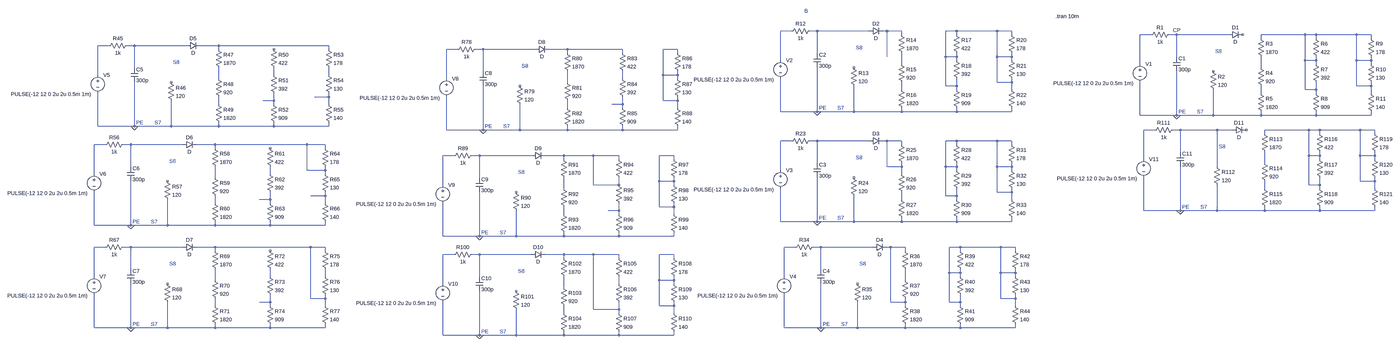
[diagram p0: schematic teste3 - Copia.asc, whole sheet]
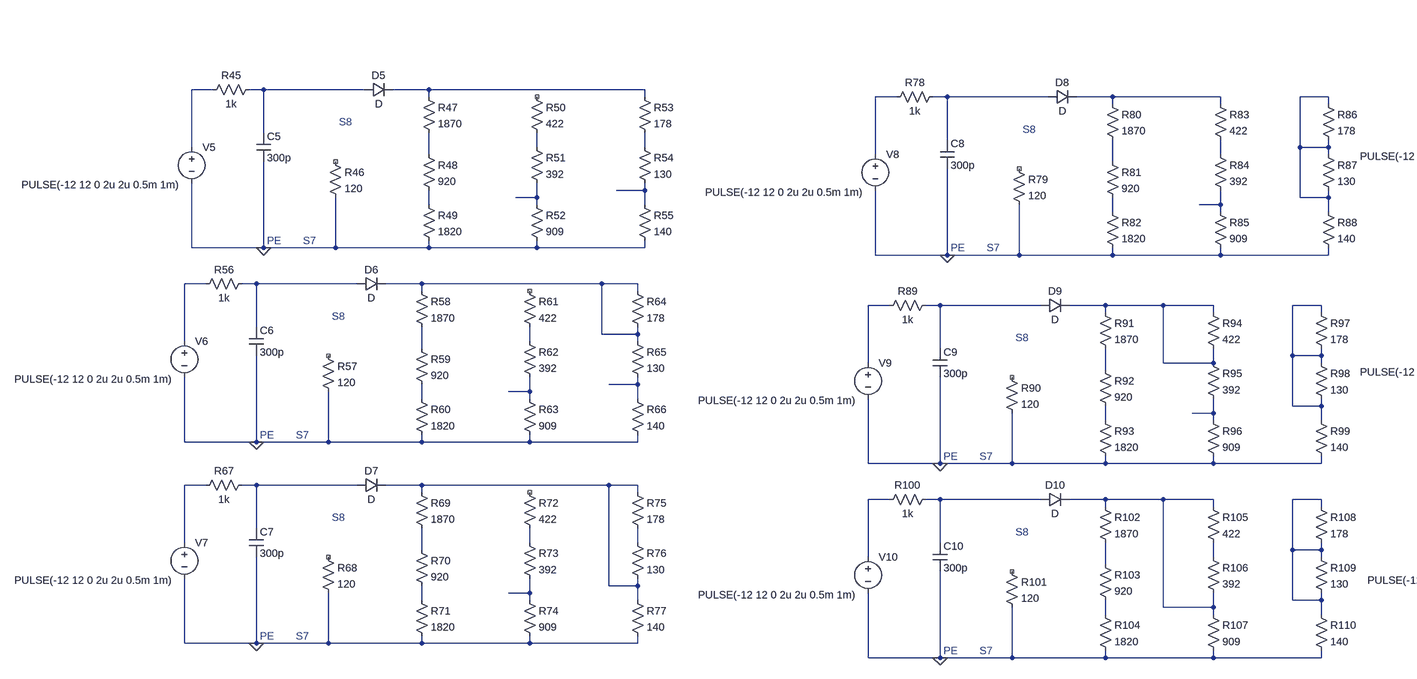
[diagram p1: schematic teste3 - Copia.asc, part, row 1 of 1, column 1 of 2]
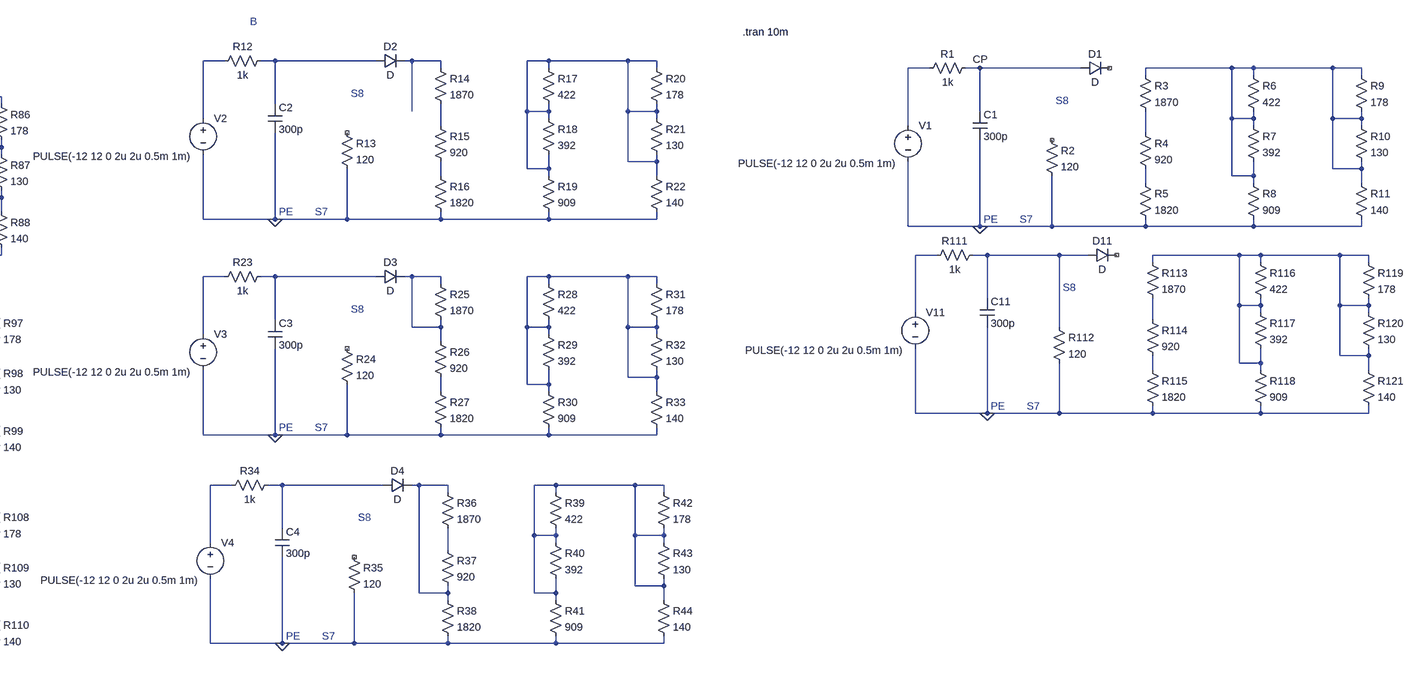
[diagram p2: schematic teste3 - Copia.asc, part, row 1 of 1, column 2 of 2]
teste3 - Copia.asc, the LTspice schematic file:
Version 4.1
SHEET 1 3600 2600
WIRE -1792 -48 -1840 -48
WIRE -1680 -48 -1712 -48
WIRE -1456 -48 -1680 -48
WIRE -1376 -48 -1392 -48
WIRE -1312 -48 -1376 -48
WIRE -1072 -48 -1120 -48
WIRE -896 -48 -1072 -48
WIRE -832 -48 -896 -48
WIRE -1312 -32 -1312 -48
WIRE -1072 -32 -1072 -48
WIRE -832 -32 -832 -48
WIRE 80 -32 32 -32
WIRE 192 -32 160 -32
WIRE 416 -32 192 -32
WIRE 752 -32 560 -32
WIRE 800 -32 752 -32
WIRE 976 -32 800 -32
WIRE 1040 -32 976 -32
WIRE 560 -16 560 -32
WIRE 800 -16 800 -32
WIRE 1040 -16 1040 -32
WIRE -4768 16 -4816 16
WIRE -4656 16 -4688 16
WIRE -4432 16 -4656 16
WIRE -4288 16 -4368 16
WIRE -3808 16 -4288 16
WIRE -4288 32 -4288 16
WIRE -3808 32 -3808 16
WIRE -3248 32 -3296 32
WIRE -3136 32 -3168 32
WIRE -2912 32 -3136 32
WIRE -2768 32 -2848 32
WIRE -2528 32 -2768 32
WIRE -2288 32 -2352 32
WIRE -2768 48 -2768 32
WIRE -2528 48 -2528 32
WIRE -2288 48 -2288 32
WIRE -1680 48 -1680 -48
WIRE -1376 64 -1376 -48
WIRE -1120 64 -1120 -48
WIRE -1072 64 -1072 48
WIRE -1072 64 -1120 64
WIRE -896 64 -896 -48
WIRE -832 64 -832 48
WIRE -832 64 -896 64
WIRE 192 64 192 -32
WIRE -1840 80 -1840 -48
WIRE -1072 80 -1072 64
WIRE -832 80 -832 64
WIRE 752 80 752 -32
WIRE 800 80 800 64
WIRE 800 80 752 80
WIRE 976 80 976 -32
WIRE 1040 80 1040 64
WIRE 1040 80 976 80
WIRE -1312 96 -1312 48
WIRE 32 96 32 -32
WIRE 800 96 800 80
WIRE 1040 96 1040 80
WIRE -4656 112 -4656 16
WIRE 560 112 560 64
WIRE -3136 128 -3136 32
WIRE -4816 144 -4816 16
WIRE -4048 144 -4048 112
WIRE -3808 144 -3808 112
WIRE -2352 144 -2352 32
WIRE -2288 144 -2288 128
WIRE -2288 144 -2352 144
WIRE -4288 160 -4288 112
WIRE -3296 160 -3296 32
WIRE -2528 160 -2528 128
WIRE -2288 160 -2288 144
WIRE -2768 176 -2768 128
WIRE -896 176 -896 64
WIRE -832 176 -832 160
WIRE -832 176 -896 176
WIRE -1120 192 -1120 64
WIRE -1072 192 -1072 160
WIRE -1072 192 -1120 192
WIRE 976 192 976 80
WIRE 1040 192 1040 176
WIRE 1040 192 976 192
WIRE -1312 208 -1312 176
WIRE -1072 208 -1072 192
WIRE -832 208 -832 176
WIRE 752 208 752 80
WIRE 800 208 800 176
WIRE 800 208 752 208
WIRE 560 224 560 192
WIRE 800 224 800 208
WIRE 1040 224 1040 192
WIRE -3808 240 -3808 224
WIRE -3808 240 -3872 240
WIRE -4048 256 -4048 224
WIRE -4048 256 -4096 256
WIRE -2352 256 -2352 144
WIRE -2288 256 -2288 240
WIRE -2288 256 -2352 256
WIRE -4288 272 -4288 240
WIRE -4048 272 -4048 256
WIRE -3808 272 -3808 240
WIRE -2528 272 -2528 240
WIRE -2528 272 -2576 272
WIRE -2768 288 -2768 256
WIRE -2528 288 -2528 272
WIRE -2288 288 -2288 256
WIRE -1840 304 -1840 160
WIRE -1680 304 -1680 112
WIRE -1680 304 -1840 304
WIRE -1520 304 -1520 192
WIRE -1520 304 -1680 304
WIRE -1312 304 -1312 288
WIRE -1312 304 -1520 304
WIRE -1072 304 -1072 288
WIRE -1072 304 -1312 304
WIRE -832 304 -832 288
WIRE -832 304 -1072 304
WIRE 32 320 32 176
WIRE 192 320 192 128
WIRE 192 320 32 320
WIRE 352 320 352 208
WIRE 352 320 192 320
WIRE 560 320 560 304
WIRE 560 320 352 320
WIRE 800 320 800 304
WIRE 800 320 560 320
WIRE 1040 320 1040 304
WIRE 1040 320 800 320
WIRE -4816 368 -4816 224
WIRE -4656 368 -4656 176
WIRE -4656 368 -4816 368
WIRE -4496 368 -4496 256
WIRE -4496 368 -4656 368
WIRE -4288 368 -4288 352
WIRE -4288 368 -4496 368
WIRE -4048 368 -4048 352
WIRE -4048 368 -4288 368
WIRE -3808 368 -3808 352
WIRE -3808 368 -4048 368
WIRE -3296 384 -3296 240
WIRE -3136 384 -3136 192
WIRE -3136 384 -3296 384
WIRE -2976 384 -2976 272
WIRE -2976 384 -3136 384
WIRE -2768 384 -2768 368
WIRE -2768 384 -2976 384
WIRE -2528 384 -2528 368
WIRE -2528 384 -2768 384
WIRE -2288 384 -2288 368
WIRE -2288 384 -2528 384
WIRE 96 384 48 384
WIRE 208 384 176 384
WIRE 368 384 208 384
WIRE 432 384 368 384
WIRE 768 384 576 384
WIRE 816 384 768 384
WIRE 992 384 816 384
WIRE 1056 384 992 384
WIRE 576 400 576 384
WIRE 816 400 816 384
WIRE 1056 400 1056 384
WIRE -1792 432 -1840 432
WIRE -1680 432 -1712 432
WIRE -1456 432 -1680 432
WIRE -1376 432 -1392 432
WIRE -1312 432 -1376 432
WIRE -1072 432 -1120 432
WIRE -896 432 -1072 432
WIRE -832 432 -896 432
WIRE -4784 448 -4832 448
WIRE -4672 448 -4704 448
WIRE -4448 448 -4672 448
WIRE -4304 448 -4384 448
WIRE -3904 448 -4304 448
WIRE -3824 448 -3904 448
WIRE -1312 448 -1312 432
WIRE -1072 448 -1072 432
WIRE -832 448 -832 432
WIRE -4304 464 -4304 448
WIRE -3824 464 -3824 448
WIRE 208 480 208 384
WIRE -3264 496 -3312 496
WIRE -3152 496 -3184 496
WIRE -2928 496 -3152 496
WIRE -2784 496 -2864 496
WIRE -2656 496 -2784 496
WIRE -2544 496 -2656 496
WIRE -2304 496 -2368 496
WIRE 768 496 768 384
WIRE 816 496 816 480
WIRE 816 496 768 496
WIRE 992 496 992 384
WIRE 1056 496 1056 480
WIRE 1056 496 992 496
WIRE -2784 512 -2784 496
WIRE -2544 512 -2544 496
WIRE -2304 512 -2304 496
WIRE 48 512 48 384
WIRE 816 512 816 496
WIRE 1056 512 1056 496
WIRE -1680 528 -1680 432
WIRE 576 528 576 480
WIRE -4672 544 -4672 448
WIRE -1376 544 -1376 432
WIRE -1312 544 -1312 528
WIRE -1312 544 -1376 544
WIRE -1120 544 -1120 432
WIRE -1072 544 -1072 528
WIRE -1072 544 -1120 544
WIRE -896 544 -896 432
WIRE -832 544 -832 528
WIRE -832 544 -896 544
WIRE 368 544 368 384
WIRE -3904 560 -3904 448
WIRE -3824 560 -3824 544
WIRE -3824 560 -3904 560
WIRE -1840 560 -1840 432
WIRE -1072 560 -1072 544
WIRE -832 560 -832 544
WIRE -4832 576 -4832 448
WIRE -4064 576 -4064 544
WIRE -3824 576 -3824 560
WIRE -1312 576 -1312 544
WIRE -4304 592 -4304 544
WIRE -3152 592 -3152 496
WIRE -2368 608 -2368 496
WIRE -2304 608 -2304 592
WIRE -2304 608 -2368 608
WIRE 992 608 992 496
WIRE 1056 608 1056 592
WIRE 1056 608 992 608
WIRE -3312 624 -3312 496
WIRE -2656 624 -2656 496
WIRE -2544 624 -2544 592
WIRE -2544 624 -2656 624
WIRE -2304 624 -2304 608
WIRE 768 624 768 496
WIRE 816 624 816 592
WIRE 816 624 768 624
WIRE -2784 640 -2784 592
WIRE 576 640 576 608
WIRE 816 640 816 624
WIRE 1056 640 1056 608
WIRE -896 656 -896 544
WIRE -832 656 -832 640
WIRE -832 656 -896 656
WIRE -3824 672 -3824 656
WIRE -3824 672 -3888 672
WIRE -1120 672 -1120 544
WIRE -1072 672 -1072 640
WIRE -1072 672 -1120 672
WIRE -4064 688 -4064 656
WIRE -4064 688 -4112 688
WIRE -1312 688 -1312 656
WIRE -1072 688 -1072 672
WIRE -832 688 -832 656
WIRE -4304 704 -4304 672
WIRE -4064 704 -4064 688
WIRE -3824 704 -3824 672
WIRE -2368 720 -2368 608
WIRE -2304 720 -2304 704
WIRE -2304 720 -2368 720
WIRE -2544 736 -2544 704
WIRE -2544 736 -2592 736
WIRE 48 736 48 592
WIRE 208 736 208 544
WIRE 208 736 48 736
WIRE 368 736 368 624
WIRE 368 736 208 736
WIRE 576 736 576 720
WIRE 576 736 368 736
WIRE 816 736 816 720
WIRE 816 736 576 736
WIRE 1056 736 1056 720
WIRE 1056 736 816 736
WIRE -2784 752 -2784 720
WIRE -2544 752 -2544 736
WIRE -2304 752 -2304 720
WIRE -1840 784 -1840 640
WIRE -1680 784 -1680 592
WIRE -1680 784 -1840 784
WIRE -1520 784 -1520 672
WIRE -1520 784 -1680 784
WIRE -1312 784 -1312 768
WIRE -1312 784 -1520 784
WIRE -1072 784 -1072 768
WIRE -1072 784 -1312 784
WIRE -832 784 -832 768
WIRE -832 784 -1072 784
WIRE -4832 800 -4832 656
WIRE -4672 800 -4672 608
WIRE -4672 800 -4832 800
WIRE -4512 800 -4512 688
WIRE -4512 800 -4672 800
WIRE -4304 800 -4304 784
WIRE -4304 800 -4512 800
WIRE -4064 800 -4064 784
WIRE -4064 800 -4304 800
WIRE -3824 800 -3824 784
WIRE -3824 800 -4064 800
WIRE -3312 848 -3312 704
WIRE -3152 848 -3152 656
WIRE -3152 848 -3312 848
WIRE -2992 848 -2992 736
WIRE -2992 848 -3152 848
WIRE -2784 848 -2784 832
WIRE -2784 848 -2992 848
WIRE -2544 848 -2544 832
WIRE -2544 848 -2784 848
WIRE -2304 848 -2304 832
WIRE -2304 848 -2544 848
WIRE -4784 896 -4832 896
WIRE -4672 896 -4704 896
WIRE -4448 896 -4672 896
WIRE -4304 896 -4384 896
WIRE -3888 896 -4304 896
WIRE -3824 896 -3888 896
WIRE -1776 896 -1824 896
WIRE -1664 896 -1696 896
WIRE -1440 896 -1664 896
WIRE -1360 896 -1376 896
WIRE -1296 896 -1360 896
WIRE -1056 896 -1104 896
WIRE -880 896 -1056 896
WIRE -816 896 -880 896
WIRE -4304 912 -4304 896
WIRE -3824 912 -3824 896
WIRE -1296 912 -1296 896
WIRE -1056 912 -1056 896
WIRE -816 912 -816 896
WIRE -3264 928 -3312 928
WIRE -3152 928 -3184 928
WIRE -2928 928 -3152 928
WIRE -2784 928 -2864 928
WIRE -2656 928 -2784 928
WIRE -2544 928 -2656 928
WIRE -2304 928 -2368 928
WIRE -2784 944 -2784 928
WIRE -2544 944 -2544 928
WIRE -2304 944 -2304 928
WIRE -4672 992 -4672 896
WIRE -1664 992 -1664 896
WIRE -1104 1008 -1104 896
WIRE -1056 1008 -1056 992
WIRE -1056 1008 -1104 1008
WIRE -880 1008 -880 896
WIRE -816 1008 -816 992
WIRE -816 1008 -880 1008
WIRE -4832 1024 -4832 896
WIRE -4064 1024 -4064 992
WIRE -3824 1024 -3824 992
WIRE -3152 1024 -3152 928
WIRE -1824 1024 -1824 896
WIRE -1056 1024 -1056 1008
WIRE -816 1024 -816 1008
WIRE -4304 1040 -4304 992
WIRE -2368 1040 -2368 928
WIRE -2304 1040 -2304 1024
WIRE -2304 1040 -2368 1040
WIRE -1296 1040 -1296 992
WIRE -3312 1056 -3312 928
WIRE -2544 1056 -2544 1024
WIRE -2304 1056 -2304 1040
WIRE -2784 1072 -2784 1024
WIRE -3888 1120 -3888 896
WIRE -3824 1120 -3824 1104
WIRE -3824 1120 -3888 1120
WIRE -880 1120 -880 1008
WIRE -816 1120 -816 1104
WIRE -816 1120 -880 1120
WIRE -4064 1136 -4064 1104
WIRE -4064 1136 -4112 1136
WIRE -1360 1136 -1360 896
WIRE -1296 1136 -1296 1120
WIRE -1296 1136 -1360 1136
WIRE -1104 1136 -1104 1008
WIRE -1056 1136 -1056 1104
WIRE -1056 1136 -1104 1136
WIRE -4304 1152 -4304 1120
WIRE -4064 1152 -4064 1136
WIRE -3824 1152 -3824 1120
WIRE -2368 1152 -2368 1040
WIRE -2304 1152 -2304 1136
WIRE -2304 1152 -2368 1152
WIRE -1296 1152 -1296 1136
WIRE -1056 1152 -1056 1136
WIRE -816 1152 -816 1120
WIRE -2656 1168 -2656 928
WIRE -2544 1168 -2544 1136
WIRE -2544 1168 -2656 1168
WIRE -2784 1184 -2784 1152
WIRE -2544 1184 -2544 1168
WIRE -2304 1184 -2304 1152
WIRE -4832 1248 -4832 1104
WIRE -4672 1248 -4672 1056
WIRE -4672 1248 -4832 1248
WIRE -4512 1248 -4512 1136
WIRE -4512 1248 -4672 1248
WIRE -4304 1248 -4304 1232
WIRE -4304 1248 -4512 1248
WIRE -4064 1248 -4064 1232
WIRE -4064 1248 -4304 1248
WIRE -3824 1248 -3824 1232
WIRE -3824 1248 -4064 1248
WIRE -1824 1248 -1824 1104
WIRE -1664 1248 -1664 1056
WIRE -1664 1248 -1824 1248
WIRE -1504 1248 -1504 1136
WIRE -1504 1248 -1664 1248
WIRE -1296 1248 -1296 1232
WIRE -1296 1248 -1504 1248
WIRE -1056 1248 -1056 1232
WIRE -1056 1248 -1296 1248
WIRE -816 1248 -816 1232
WIRE -816 1248 -1056 1248
WIRE -3312 1280 -3312 1136
WIRE -3152 1280 -3152 1088
WIRE -3152 1280 -3312 1280
WIRE -2992 1280 -2992 1168
WIRE -2992 1280 -3152 1280
WIRE -2784 1280 -2784 1264
WIRE -2784 1280 -2992 1280
WIRE -2544 1280 -2544 1264
WIRE -2544 1280 -2784 1280
WIRE -2304 1280 -2304 1264
WIRE -2304 1280 -2544 1280
FLAG 192 320 0
FLAG 192 -32 CP
FLAG -1680 304 0
FLAG -1680 784 0
FLAG -1664 1248 0
FLAG -4656 368 0
FLAG -3136 384 0
FLAG -3152 848 0
FLAG -3152 1280 0
FLAG -4672 800 0
FLAG -4672 1248 0
FLAG 208 736 0
SYMBOL voltage 32 80 R0
WINDOW 3 -378 100 Left 2
WINDOW 123 0 0 Left 0
WINDOW 39 0 0 Left 0
SYMATTR Value PULSE(-12 12 0 2u 2u 0.5m 1m)
SYMATTR InstName V1
SYMBOL res 176 -48 R90
WINDOW 0 0 56 VBottom 2
WINDOW 3 32 56 VTop 2
SYMATTR InstName R1
SYMATTR Value 1k
SYMBOL cap 176 64 R0
SYMATTR InstName C1
SYMATTR Value 300p
SYMBOL res 336 112 R0
SYMATTR InstName R2
SYMATTR Value 120
SYMBOL res 544 -32 R0
SYMATTR InstName R3
SYMATTR Value 1870
SYMBOL res 544 96 R0
SYMATTR InstName R4
SYMATTR Value 920
SYMBOL res 544 208 R0
SYMATTR InstName R5
SYMATTR Value 1820
SYMBOL res 784 -32 R0
SYMATTR InstName R6
SYMATTR Value 422
SYMBOL res 784 80 R0
SYMATTR InstName R7
SYMATTR Value 392
SYMBOL res 784 208 R0
SYMATTR InstName R8
SYMATTR Value 909
SYMBOL res 1024 -32 R0
SYMATTR InstName R9
SYMATTR Value 178
SYMBOL res 1024 80 R0
SYMATTR InstName R10
SYMATTR Value 130
SYMBOL res 1024 208 R0
SYMATTR InstName R11
SYMATTR Value 140
SYMBOL diode 416 -16 R270
WINDOW 0 32 32 VTop 2
WINDOW 3 0 32 VBottom 2
SYMATTR InstName D1
SYMBOL voltage -1840 64 R0
WINDOW 3 -378 100 Left 2
WINDOW 123 0 0 Left 0
WINDOW 39 0 0 Left 0
SYMATTR Value PULSE(-12 12 0 2u 2u 0.5m 1m)
SYMATTR InstName V2
SYMBOL res -1696 -64 R90
WINDOW 0 0 56 VBottom 2
WINDOW 3 32 56 VTop 2
SYMATTR InstName R12
SYMATTR Value 1k
SYMBOL cap -1696 48 R0
SYMATTR InstName C2
SYMATTR Value 300p
SYMBOL res -1536 96 R0
SYMATTR InstName R13
SYMATTR Value 120
SYMBOL res -1328 -48 R0
SYMATTR InstName R14
SYMATTR Value 1870
SYMBOL res -1328 80 R0
SYMATTR InstName R15
SYMATTR Value 920
SYMBOL res -1328 192 R0
SYMATTR InstName R16
SYMATTR Value 1820
SYMBOL res -1088 -48 R0
SYMATTR InstName R17
SYMATTR Value 422
SYMBOL res -1088 64 R0
SYMATTR InstName R18
SYMATTR Value 392
SYMBOL res -1088 192 R0
SYMATTR InstName R19
SYMATTR Value 909
SYMBOL res -848 -48 R0
SYMATTR InstName R20
SYMATTR Value 178
SYMBOL res -848 64 R0
SYMATTR InstName R21
SYMATTR Value 130
SYMBOL res -848 192 R0
SYMATTR InstName R22
SYMATTR Value 140
SYMBOL diode -1456 -32 R270
WINDOW 0 32 32 VTop 2
WINDOW 3 0 32 VBottom 2
SYMATTR InstName D2
SYMBOL voltage -1840 544 R0
WINDOW 3 -378 100 Left 2
WINDOW 123 0 0 Left 0
WINDOW 39 0 0 Left 0
SYMATTR Value PULSE(-12 12 0 2u 2u 0.5m 1m)
SYMATTR InstName V3
SYMBOL res -1696 416 R90
WINDOW 0 0 56 VBottom 2
WINDOW 3 32 56 VTop 2
SYMATTR InstName R23
SYMATTR Value 1k
SYMBOL cap -1696 528 R0
SYMATTR InstName C3
SYMATTR Value 300p
SYMBOL res -1536 576 R0
SYMATTR InstName R24
SYMATTR Value 120
SYMBOL res -1328 432 R0
SYMATTR InstName R25
SYMATTR Value 1870
SYMBOL res -1328 560 R0
SYMATTR InstName R26
SYMATTR Value 920
SYMBOL res -1328 672 R0
SYMATTR InstName R27
SYMATTR Value 1820
SYMBOL res -1088 432 R0
SYMATTR InstName R28
SYMATTR Value 422
SYMBOL res -1088 544 R0
SYMATTR InstName R29
SYMATTR Value 392
SYMBOL res -1088 672 R0
SYMATTR InstName R30
SYMATTR Value 909
SYMBOL res -848 432 R0
SYMATTR InstName R31
SYMATTR Value 178
SYMBOL res -848 544 R0
SYMATTR InstName R32
SYMATTR Value 130
SYMBOL res -848 672 R0
SYMATTR InstName R33
SYMATTR Value 140
SYMBOL diode -1456 448 R270
WINDOW 0 32 32 VTop 2
WINDOW 3 0 32 VBottom 2
SYMATTR InstName D3
SYMBOL voltage -1824 1008 R0
WINDOW 3 -378 100 Left 2
WINDOW 123 0 0 Left 0
WINDOW 39 0 0 Left 0
SYMATTR Value PULSE(-12 12 0 2u 2u 0.5m 1m)
SYMATTR InstName V4
SYMBOL res -1680 880 R90
WINDOW 0 0 56 VBottom 2
WINDOW 3 32 56 VTop 2
SYMATTR InstName R34
SYMATTR Value 1k
SYMBOL cap -1680 992 R0
SYMATTR InstName C4
SYMATTR Value 300p
SYMBOL res -1520 1040 R0
SYMATTR InstName R35
SYMATTR Value 120
SYMBOL res -1312 896 R0
SYMATTR InstName R36
SYMATTR Value 1870
SYMBOL res -1312 1024 R0
SYMATTR InstName R37
SYMATTR Value 920
SYMBOL res -1312 1136 R0
SYMATTR InstName R38
SYMATTR Value 1820
SYMBOL res -1072 896 R0
SYMATTR InstName R39
SYMATTR Value 422
SYMBOL res -1072 1008 R0
SYMATTR InstName R40
SYMATTR Value 392
SYMBOL res -1072 1136 R0
SYMATTR InstName R41
SYMATTR Value 909
SYMBOL res -832 896 R0
SYMATTR InstName R42
SYMATTR Value 178
SYMBOL res -832 1008 R0
SYMATTR InstName R43
SYMATTR Value 130
SYMBOL res -832 1136 R0
SYMATTR InstName R44
SYMATTR Value 140
SYMBOL diode -1440 912 R270
WINDOW 0 32 32 VTop 2
WINDOW 3 0 32 VBottom 2
SYMATTR InstName D4
SYMBOL voltage -4816 128 R0
WINDOW 3 -378 100 Left 2
WINDOW 123 0 0 Left 0
WINDOW 39 0 0 Left 0
SYMATTR Value PULSE(-12 12 0 2u 2u 0.5m 1m)
SYMATTR InstName V5
SYMBOL res -4672 0 R90
WINDOW 0 0 56 VBottom 2
WINDOW 3 32 56 VTop 2
SYMATTR InstName R45
SYMATTR Value 1k
SYMBOL cap -4672 112 R0
SYMATTR InstName C5
SYMATTR Value 300p
SYMBOL res -4512 160 R0
SYMATTR InstName R46
SYMATTR Value 120
SYMBOL res -4304 16 R0
SYMATTR InstName R47
SYMATTR Value 1870
SYMBOL res -4304 144 R0
SYMATTR InstName R48
SYMATTR Value 920
SYMBOL res -4304 256 R0
SYMATTR InstName R49
SYMATTR Value 1820
SYMBOL res -4064 16 R0
SYMATTR InstName R50
SYMATTR Value 422
SYMBOL res -4064 128 R0
SYMATTR InstName R51
SYMATTR Value 392
SYMBOL res -4064 256 R0
SYMATTR InstName R52
SYMATTR Value 909
SYMBOL res -3824 16 R0
SYMATTR InstName R53
SYMATTR Value 178
SYMBOL res -3824 128 R0
SYMATTR InstName R54
SYMATTR Value 130
SYMBOL res -3824 256 R0
SYMATTR InstName R55
SYMATTR Value 140
SYMBOL diode -4432 32 R270
WINDOW 0 32 32 VTop 2
WINDOW 3 0 32 VBottom 2
SYMATTR InstName D5
SYMBOL voltage -3296 144 R0
WINDOW 3 -378 100 Left 2
WINDOW 123 0 0 Left 0
WINDOW 39 0 0 Left 0
SYMATTR Value PULSE(-12 12 0 2u 2u 0.5m 1m)
SYMATTR InstName V8
SYMBOL res -3152 16 R90
WINDOW 0 0 56 VBottom 2
WINDOW 3 32 56 VTop 2
SYMATTR InstName R78
SYMATTR Value 1k
SYMBOL cap -3152 128 R0
SYMATTR InstName C8
SYMATTR Value 300p
SYMBOL res -2992 176 R0
SYMATTR InstName R79
SYMATTR Value 120
SYMBOL res -2784 32 R0
SYMATTR InstName R80
SYMATTR Value 1870
SYMBOL res -2784 160 R0
SYMATTR InstName R81
SYMATTR Value 920
SYMBOL res -2784 272 R0
SYMATTR InstName R82
SYMATTR Value 1820
SYMBOL res -2544 32 R0
SYMATTR InstName R83
SYMATTR Value 422
SYMBOL res -2544 144 R0
SYMATTR InstName R84
SYMATTR Value 392
SYMBOL res -2544 272 R0
SYMATTR InstName R85
SYMATTR Value 909
SYMBOL res -2304 32 R0
SYMATTR InstName R86
SYMATTR Value 178
SYMBOL res -2304 144 R0
SYMATTR InstName R87
SYMATTR Value 130
SYMBOL res -2304 272 R0
SYMATTR InstName R88
SYMATTR Value 140
SYMBOL diode -2912 48 R270
WINDOW 0 32 32 VTop 2
WINDOW 3 0 32 VBottom 2
SYMATTR InstName D8
SYMBOL voltage -3312 608 R0
WINDOW 3 -378 100 Left 2
WINDOW 123 0 0 Left 0
WINDOW 39 0 0 Left 0
SYMATTR Value PULSE(-12 12 0 2u 2u 0.5m 1m)
SYMATTR InstName V9
SYMBOL res -3168 480 R90
WINDOW 0 0 56 VBottom 2
WINDOW 3 32 56 VTop 2
SYMATTR InstName R89
SYMATTR Value 1k
SYMBOL cap -3168 592 R0
SYMATTR InstName C9
SYMATTR Value 300p
SYMBOL res -3008 640 R0
SYMATTR InstName R90
SYMATTR Value 120
SYMBOL res -2800 496 R0
SYMATTR InstName R91
SYMATTR Value 1870
SYMBOL res -2800 624 R0
SYMATTR InstName R92
SYMATTR Value 920
SYMBOL res -2800 736 R0
SYMATTR InstName R93
SYMATTR Value 1820
SYMBOL res -2560 496 R0
SYMATTR InstName R94
SYMATTR Value 422
SYMBOL res -2560 608 R0
SYMATTR InstName R95
SYMATTR Value 392
SYMBOL res -2560 736 R0
SYMATTR InstName R96
SYMATTR Value 909
SYMBOL res -2320 496 R0
SYMATTR InstName R97
SYMATTR Value 178
SYMBOL res -2320 608 R0
SYMATTR InstName R98
SYMATTR Value 130
SYMBOL res -2320 736 R0
SYMATTR InstName R99
SYMATTR Value 140
SYMBOL diode -2928 512 R270
WINDOW 0 32 32 VTop 2
WINDOW 3 0 32 VBottom 2
SYMATTR InstName D9
SYMBOL voltage -3312 1040 R0
WINDOW 3 -378 100 Left 2
WINDOW 123 0 0 Left 0
WINDOW 39 0 0 Left 0
SYMATTR Value PULSE(-12 12 0 2u 2u 0.5m 1m)
SYMATTR InstName V10
SYMBOL res -3168 912 R90
WINDOW 0 0 56 VBottom 2
WINDOW 3 32 56 VTop 2
SYMATTR InstName R100
SYMATTR Value 1k
SYMBOL cap -3168 1024 R0
SYMATTR InstName C10
SYMATTR Value 300p
SYMBOL res -3008 1072 R0
SYMATTR InstName R101
SYMATTR Value 120
SYMBOL res -2800 928 R0
SYMATTR InstName R102
SYMATTR Value 1870
SYMBOL res -2800 1056 R0
SYMATTR InstName R103
SYMATTR Value 920
SYMBOL res -2800 1168 R0
SYMATTR InstName R104
SYMATTR Value 1820
SYMBOL res -2560 928 R0
SYMATTR InstName R105
SYMATTR Value 422
SYMBOL res -2560 1040 R0
SYMATTR InstName R106
SYMATTR Value 392
SYMBOL res -2560 1168 R0
SYMATTR InstName R107
SYMATTR Value 909
SYMBOL res -2320 928 R0
SYMATTR InstName R108
SYMATTR Value 178
SYMBOL res -2320 1040 R0
SYMATTR InstName R109
SYMATTR Value 130
SYMBOL res -2320 1168 R0
SYMATTR InstName R110
SYMATTR Value 140
SYMBOL diode -2928 944 R270
WINDOW 0 32 32 VTop 2
WINDOW 3 0 32 VBottom 2
SYMATTR InstName D10
SYMBOL voltage -4832 560 R0
WINDOW 3 -378 100 Left 2
WINDOW 123 0 0 Left 0
WINDOW 39 0 0 Left 0
SYMATTR Value PULSE(-12 12 0 2u 2u 0.5m 1m)
SYMATTR InstName V6
SYMBOL res -4688 432 R90
WINDOW 0 0 56 VBottom 2
WINDOW 3 32 56 VTop 2
SYMATTR InstName R56
SYMATTR Value 1k
SYMBOL cap -4688 544 R0
SYMATTR InstName C6
SYMATTR Value 300p
SYMBOL res -4528 592 R0
SYMATTR InstName R57
SYMATTR Value 120
SYMBOL res -4320 448 R0
SYMATTR InstName R58
SYMATTR Value 1870
SYMBOL res -4320 576 R0
SYMATTR InstName R59
SYMATTR Value 920
SYMBOL res -4320 688 R0
SYMATTR InstName R60
SYMATTR Value 1820
SYMBOL res -4080 448 R0
SYMATTR InstName R61
SYMATTR Value 422
SYMBOL res -4080 560 R0
SYMATTR InstName R62
SYMATTR Value 392
SYMBOL res -4080 688 R0
SYMATTR InstName R63
SYMATTR Value 909
SYMBOL res -3840 448 R0
SYMATTR InstName R64
SYMATTR Value 178
SYMBOL res -3840 560 R0
SYMATTR InstName R65
SYMATTR Value 130
SYMBOL res -3840 688 R0
SYMATTR InstName R66
SYMATTR Value 140
SYMBOL diode -4448 464 R270
WINDOW 0 32 32 VTop 2
WINDOW 3 0 32 VBottom 2
SYMATTR InstName D6
SYMBOL voltage -4832 1008 R0
WINDOW 3 -378 100 Left 2
WINDOW 123 0 0 Left 0
WINDOW 39 0 0 Left 0
SYMATTR Value PULSE(-12 12 0 2u 2u 0.5m 1m)
SYMATTR InstName V7
SYMBOL res -4688 880 R90
WINDOW 0 0 56 VBottom 2
WINDOW 3 32 56 VTop 2
SYMATTR InstName R67
SYMATTR Value 1k
SYMBOL cap -4688 992 R0
SYMATTR InstName C7
SYMATTR Value 300p
SYMBOL res -4528 1040 R0
SYMATTR InstName R68
SYMATTR Value 120
SYMBOL res -4320 896 R0
SYMATTR InstName R69
SYMATTR Value 1870
SYMBOL res -4320 1024 R0
SYMATTR InstName R70
SYMATTR Value 920
SYMBOL res -4320 1136 R0
SYMATTR InstName R71
SYMATTR Value 1820
SYMBOL res -4080 896 R0
SYMATTR InstName R72
SYMATTR Value 422
SYMBOL res -4080 1008 R0
SYMATTR InstName R73
SYMATTR Value 392
SYMBOL res -4080 1136 R0
SYMATTR InstName R74
SYMATTR Value 909
SYMBOL res -3840 896 R0
SYMATTR InstName R75
SYMATTR Value 178
SYMBOL res -3840 1008 R0
SYMATTR InstName R76
SYMATTR Value 130
SYMBOL res -3840 1136 R0
SYMATTR InstName R77
SYMATTR Value 140
SYMBOL diode -4448 912 R270
WINDOW 0 32 32 VTop 2
WINDOW 3 0 32 VBottom 2
SYMATTR InstName D7
SYMBOL voltage 48 496 R0
WINDOW 3 -378 100 Left 2
WINDOW 123 0 0 Left 0
WINDOW 39 0 0 Left 0
SYMATTR Value PULSE(-12 12 0 2u 2u 0.5m 1m)
SYMATTR InstName V11
SYMBOL res 192 368 R90
WINDOW 0 0 56 VBottom 2
WINDOW 3 32 56 VTop 2
SYMATTR InstName R111
SYMATTR Value 1k
SYMBOL cap 192 480 R0
SYMATTR InstName C11
SYMATTR Value 300p
SYMBOL res 352 528 R0
SYMATTR InstName R112
SYMATTR Value 120
SYMBOL res 560 384 R0
SYMATTR InstName R113
SYMATTR Value 1870
SYMBOL res 560 512 R0
SYMATTR InstName R114
SYMATTR Value 920
SYMBOL res 560 624 R0
SYMATTR InstName R115
SYMATTR Value 1820
SYMBOL res 800 384 R0
SYMATTR InstName R116
SYMATTR Value 422
SYMBOL res 800 496 R0
SYMATTR InstName R117
SYMATTR Value 392
SYMBOL res 800 624 R0
SYMATTR InstName R118
SYMATTR Value 909
SYMBOL res 1040 384 R0
SYMATTR InstName R119
SYMATTR Value 178
SYMBOL res 1040 496 R0
SYMATTR InstName R120
SYMATTR Value 130
SYMBOL res 1040 624 R0
SYMATTR InstName R121
SYMATTR Value 140
SYMBOL diode 432 400 R270
WINDOW 0 32 32 VTop 2
WINDOW 3 0 32 VBottom 2
SYMATTR InstName D11
TEXT -336 -112 Left 2 !.tran 10m
TEXT 200 304 Left 2 ;PE
TEXT 360 40 Left 2 ;S8
TEXT 280 304 Left 2 ;S7
TEXT -1672 288 Left 2 ;PE
TEXT -1512 24 Left 2 ;S8
TEXT -1592 288 Left 2 ;S7
TEXT -1672 768 Left 2 ;PE
TEXT -1512 504 Left 2 ;S8
TEXT -1592 768 Left 2 ;S7
TEXT -1656 1232 Left 2 ;PE
TEXT -1496 968 Left 2 ;S8
TEXT -1576 1232 Left 2 ;S7
TEXT -1736 -136 Left 2 ;B
TEXT -4648 352 Left 2 ;PE
TEXT -4488 88 Left 2 ;S8
TEXT -4568 352 Left 2 ;S7
TEXT -3128 368 Left 2 ;PE
TEXT -2968 104 Left 2 ;S8
TEXT -3048 368 Left 2 ;S7
TEXT -3144 832 Left 2 ;PE
TEXT -2984 568 Left 2 ;S8
TEXT -3064 832 Left 2 ;S7
TEXT -3144 1264 Left 2 ;PE
TEXT -2984 1000 Left 2 ;S8
TEXT -3064 1264 Left 2 ;S7
TEXT -4664 784 Left 2 ;PE
TEXT -4504 520 Left 2 ;S8
TEXT -4584 784 Left 2 ;S7
TEXT -4664 1232 Left 2 ;PE
TEXT -4504 968 Left 2 ;S8
TEXT -4584 1232 Left 2 ;S7
TEXT 216 720 Left 2 ;PE
TEXT 376 456 Left 2 ;S8
TEXT 296 720 Left 2 ;S7

The netlist it stands for:
* teste3 - Copia.asc
V1 N005 0 PULSE(-12 12 0 2u 2u 0.5m 1m)
R1 CP N005 1k
C1 CP 0 300p
R2 NC_01 0 120
R3 N006 N015 1870
R4 N015 N022 920
R5 N022 0 1820
R6 N006 N006 422
R7 N006 N006 392
R8 N006 0 909
R9 N006 N006 178
R10 N006 N006 130
R11 N006 0 140
D1 CP NC_02 D
V2 N001 0 PULSE(-12 12 0 2u 2u 0.5m 1m)
R12 N002 N001 1k
C2 N002 0 300p
R13 NC_03 0 120
R14 N003 N014 1870
R15 N014 N021 920
R16 N021 0 1820
R17 N004 N004 422
R18 N004 N004 392
R19 N004 0 909
R20 N004 N004 178
R21 N004 N004 130
R22 N004 0 140
D2 N002 N003 D
V3 N031 0 PULSE(-12 12 0 2u 2u 0.5m 1m)
R23 N032 N031 1k
C3 N032 0 300p
R24 NC_04 0 120
R25 N033 N033 1870
R26 N033 N049 920
R27 N049 0 1820
R28 N034 N034 422
R29 N034 N034 392
R30 N034 0 909
R31 N034 N034 178
R32 N034 N034 130
R33 N034 0 140
D3 N032 N033 D
V4 N056 0 PULSE(-12 12 0 2u 2u 0.5m 1m)
R34 N057 N056 1k
C4 N057 0 300p
R35 NC_05 0 120
R36 N058 N067 1870
R37 N067 N058 920
R38 N058 0 1820
R39 N059 N059 422
R40 N059 N059 392
R41 N059 0 909
R42 N059 N059 178
R43 N059 N059 130
R44 N059 0 140
D4 N057 N058 D
V5 N007 0 PULSE(-12 12 0 2u 2u 0.5m 1m)
R45 N008 N007 1k
C5 N008 0 300p
R46 NC_06 0 120
R47 N009 N018 1870
R48 N018 N025 920
R49 N025 0 1820
R50 NC_07 N016 422
R51 N016 N024 392
R52 N024 0 909
R53 N009 N017 178
R54 N017 N023 130
R55 N023 0 140
D5 N008 N009 D
V8 N010 0 PULSE(-12 12 0 2u 2u 0.5m 1m)
R78 N011 N010 1k
C8 N011 0 300p
R79 NC_08 0 120
R80 N012 N020 1870
R81 N020 N027 920
R82 N027 0 1820
R83 N012 N019 422
R84 N019 N026 392
R85 N026 0 909
R86 N013 N013 178
R87 N013 N013 130
R88 N013 0 140
D8 N011 N012 D
V9 N038 0 PULSE(-12 12 0 2u 2u 0.5m 1m)
R89 N039 N038 1k
C9 N039 0 300p
R90 NC_09 0 120
R91 N040 N045 1870
R92 N045 N052 920
R93 N052 0 1820
R94 N040 N040 422
R95 N040 N051 392
R96 N051 0 909
R97 N041 N041 178
R98 N041 N041 130
R99 N041 0 140
D9 N039 N040 D
V10 N060 0 PULSE(-12 12 0 2u 2u 0.5m 1m)
R100 N061 N060 1k
C10 N061 0 300p
R101 NC_10 0 120
R102 N062 N069 1870
R103 N069 N072 920
R104 N072 0 1820
R105 N062 N068 422
R106 N068 N062 392
R107 N062 0 909
R108 N063 N063 178
R109 N063 N063 130
R110 N063 0 140
D10 N061 N062 D
V6 N035 0 PULSE(-12 12 0 2u 2u 0.5m 1m)
R56 N036 N035 1k
C6 N036 0 300p
R57 NC_11 0 120
R58 N037 N044 1870
R59 N044 N050 920
R60 N050 0 1820
R61 NC_12 N043 422
R62 N043 N048 392
R63 N048 0 909
R64 N037 N037 178
R65 N037 N047 130
R66 N047 0 140
D6 N036 N037 D
V7 N053 0 PULSE(-12 12 0 2u 2u 0.5m 1m)
R67 N054 N053 1k
C7 N054 0 300p
R68 NC_13 0 120
R69 N055 N066 1870
R70 N066 N071 920
R71 N071 0 1820
R72 NC_14 N064 422
R73 N064 N070 392
R74 N070 0 909
R75 N055 N065 178
R76 N065 N055 130
R77 N055 0 140
D7 N054 N055 D
V11 N028 0 PULSE(-12 12 0 2u 2u 0.5m 1m)
R111 N029 N028 1k
C11 N029 0 300p
R112 N029 0 120
R113 N030 N042 1870
R114 N042 N046 920
R115 N046 0 1820
R116 N030 N030 422
R117 N030 N030 392
R118 N030 0 909
R119 N030 N030 178
R120 N030 N030 130
R121 N030 0 140
D11 N029 NC_15 D
.model D D
.lib standard.dio
.tran 10m
* PE
* S8
* S7
* PE
* S8
* S7
* PE
* S8
* S7
* PE
* S8
* S7
* B
* PE
* S8
* S7
* PE
* S8
* S7
* PE
* S8
* S7
* PE
* S8
* S7
* PE
* S8
* S7
* PE
* S8
* S7
* PE
* S8
* S7
.backanno
.end